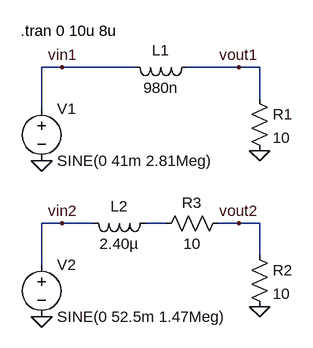
[diagram p0: schematic decadebox_inductance.asc]
decadebox_inductance.asc, the LTspice schematic file:
Version 4
SHEET 1 880 680
WIRE 160 96 128 96
WIRE 272 96 160 96
WIRE 432 96 352 96
WIRE 464 96 432 96
WIRE 464 144 464 96
WIRE 128 160 128 96
WIRE 160 336 128 336
WIRE 208 336 160 336
WIRE 320 336 288 336
WIRE 432 336 400 336
WIRE 464 336 432 336
WIRE 464 384 464 336
WIRE 128 400 128 336
FLAG 128 240 0
FLAG 464 224 0
FLAG 160 96 vin1
FLAG 432 96 vout1
FLAG 128 480 0
FLAG 464 464 0
FLAG 160 336 vin2
FLAG 432 336 vout2
SYMBOL voltage 128 144 R0
WINDOW 123 0 0 Left 0
WINDOW 39 0 0 Left 0
SYMATTR InstName V1
SYMATTR Value SINE(0 41m 2.81Meg)
SYMBOL ind 368 80 R90
WINDOW 0 5 56 VBottom 2
WINDOW 3 32 56 VTop 2
SYMATTR InstName L1
SYMATTR Value 980n
SYMBOL res 448 128 R0
SYMATTR InstName R1
SYMATTR Value 10
SYMBOL voltage 128 384 R0
WINDOW 123 0 0 Left 0
WINDOW 39 0 0 Left 0
SYMATTR InstName V2
SYMATTR Value SINE(0 52.5m 1.47Meg)
SYMBOL ind 304 320 R90
WINDOW 0 5 56 VBottom 2
WINDOW 3 32 56 VTop 2
SYMATTR InstName L2
SYMATTR Value 2.40µ
SYMBOL res 448 368 R0
SYMATTR InstName R2
SYMATTR Value 10
SYMBOL res 416 320 R90
WINDOW 0 0 56 VBottom 2
WINDOW 3 32 56 VTop 2
SYMATTR InstName R3
SYMATTR Value 10
TEXT 96 40 Left 2 !.tran 0 10u 8u

The netlist it stands for:
* decadebox_inductance.asc
V1 vin1 0 SINE(0 41m 2.81Meg)
L1 vout1 vin1 980n
R1 vout1 0 10
V2 vin2 0 SINE(0 52.5m 1.47Meg)
L2 N001 vin2 2.40µ
R2 vout2 0 10
R3 vout2 N001 10
.tran 0 10u 8u
.backanno
.end